# Altium schematic sheet QSPI.SchDoc: Quad SPI Flash Memory
size A4; Date: 01-DEC-2013; Author: A.B; CompanyName: STMicroelectronics; Organization: Microcontrollers Division; Address1: 12, Rue Jules HOROWITZ; Address2: 38019 Grenoble; Address3: FRANCE; DocumentNumber: MB1184; Revision: C-01; SheetNumber: 9; SheetTotal: 10; Project: STM32L476G-DISCO
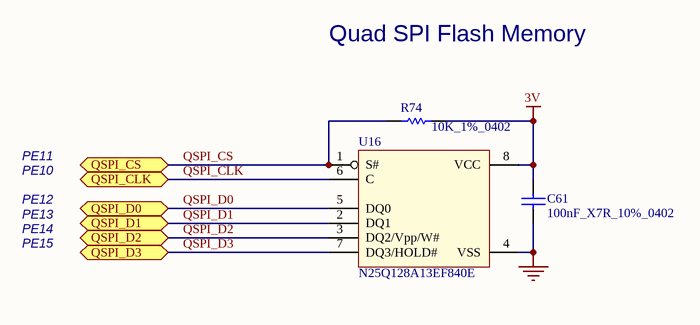
[diagram p0: QSPI.SchDoc]

## Parts
C61  100nF_X7R_10%_0402  [0402C]
R74  10K_1%_0402  [0402R]
U16  N25Q128A13EF840E  [V-PDFN-8 8x6]

## Ports
QSPI_CLK, QSPI_CS, QSPI_D0, QSPI_D1, QSPI_D2 (bidir), QSPI_D3

## Nets
3V: C61.2 R74.2 U16.8(VCC)
GND: C61.1 U16.4(VSS)
QSPI_CLK: U16.6(C) ; port QSPI_CLK
QSPI_CS: R74.1 U16.1(S#) ; port QSPI_CS
QSPI_D0: U16.5(DQ0) ; port QSPI_D0
QSPI_D1: U16.2(DQ1) ; port QSPI_D1
QSPI_D2: U16.3(DQ2/Vpp/W#) ; port QSPI_D2
QSPI_D3: U16.7(DQ3/HOLD#) ; port QSPI_D3

## Notes on the sheet
- Quad SPI Flash Memory
- PE10
- PE11
- PE12
- PE13
- PE14
- PE15
- Title:
- Project:
- Size:
- Date:
- A4
- Reference:
- Sheet:
- Revision:
- of

## Library data of the parts
C61 = Cap_100nF_X7R_10%_0402: Capacitor,100nF,16V,X7R,10%,0402,YAGEO; Manuf_Part_1: CC0402KRX7R7BB104; Revision: July-2002: Re-released for DXP Platform.; Value: 100nF; Order: CC0402KRX7R7BB104; Manuf_1: YAGEO; ECCN_US/EU: n/a
R74 = Res_10K_1%_0402: Resistor,10K,0402,1%,YAGEO; Manuf_Part_1: RC0402FR-0710KL; Value: 10K; Manuf_1: YAGEO; Order: RC0402FR-0710KL; ECCN_US/EU: n/a
U16 = N25Q128A13EF840E: 128Mb, 3V, Multiple I/O Serial Flash Memory, Quad/Dual; Manuf_1: MICRON; Manuf_Part_2: N25Q256A13EF840E; Manuf_Part_3: N25Q512A13EF840E; ECCN_US/EU: 3A991/NEC; Order: N25Q128A13EF840F-ND; Manuf_Part_1: N25Q128A13EF840E; Distrib: DIGIKEY